# EasyEDA schematic circuit_diagram_source.json
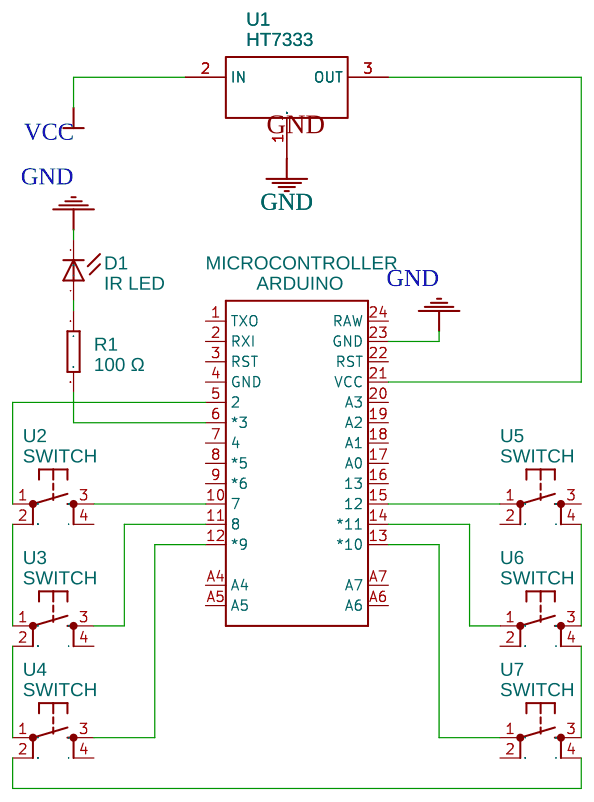
[diagram p0: schematic sheet]

## Parts
D1  IR LED  [LED-5MM-90DEG]
MICROCONTROLLER  ARDUINO  [ARDUINO_PRO_MINI]
R1  100 Ω  [RTH025W]
U1  HT7333  [TO92]
U2  SWITCH  [TAC-SWITCH-PTH]
U3  SWITCH  [TAC-SWITCH-PTH]
U4  SWITCH  [TAC-SWITCH-PTH]
U5  SWITCH  [TAC-SWITCH-PTH]
U6  SWITCH  [TAC-SWITCH-PTH]
U7  SWITCH  [TAC-SWITCH-PTH]

## Library data of the parts
D1 R1 = -: Contributor: DangerousPrototype
MICROCONTROLLER = -: Contributor: SparkFun
U1 = -: Low Power Consumption LDO, Output Voltage 3.3V, TO92 Pkg
U2-U7 = -: Tactile Switch 4 Pins, SPST NO; Contributor: SparkFun

## Nets
GND: D1.K(C) MICROCONTROLLER.23(GND) U1.1(GND)
VCC: U1.2(IN)
Net-(D1-A): D1.A R1.1
Net-(MICROCONTROLLER-5): MICROCONTROLLER.5(2) U2.1
Net-(MICROCONTROLLER-6): MICROCONTROLLER.6(*3) R1.2
Net-(MICROCONTROLLER-10): MICROCONTROLLER.10(7) U2.3
Net-(MICROCONTROLLER-11): MICROCONTROLLER.11(8) U3.3
Net-(MICROCONTROLLER-12): MICROCONTROLLER.12(*9) U4.3
Net-(MICROCONTROLLER-13): MICROCONTROLLER.13(*10) U7.1
Net-(MICROCONTROLLER-14): MICROCONTROLLER.14(*11) U6.1
Net-(MICROCONTROLLER-15): MICROCONTROLLER.15(12) U5.1
Net-(MICROCONTROLLER-21): MICROCONTROLLER.21(VCC) U1.3(OUT)
Net-(U2-2): U2.2 U3.1
Net-(U3-2): U3.2 U4.1
Net-(U4-2): U4.2 U7.4
Net-(U5-4): U5.4 U6.3
Net-(U6-4): U6.4 U7.3

Not connected (* = marked no-connect by the designer): MICROCONTROLLER 1(TXO) 2(RXI) 3(RST) 4(GND) 7(4) 8(*5) 9(*6) 16(13) 17(A0) 18(A1) 19(A2) 20(A3) 22(RST) 24(RAW) A4 A5 A6 A7; U2 4; U3 4; U4 4; U5 2 3; U6 2; U7 2
